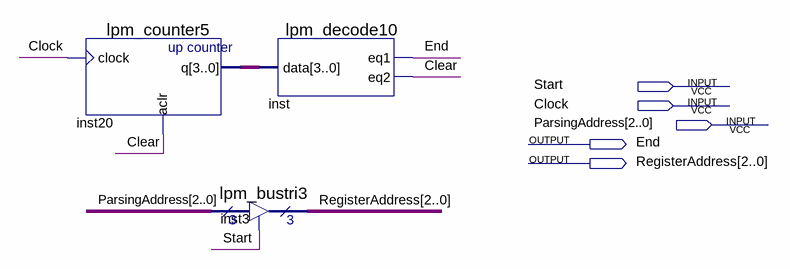
[diagram p0: schematic sheet]
// Quartus schematic Pop.bdf as structural Verilog: 3 symbols, 5 pins
module Pop (
  input  Start,
  input  Clock,
  input  [2:0] ParsingAddress,
  output End,
  output [2:0] RegisterAddress
);

  wire Clear;
  wire [3:0] inst20_q;

  lpm_counter5 inst20 (.clock(Clock), .aclr(Clear), .q(inst20_q));
  lpm_decode10 inst (.data(inst20_q), .eq1(End), .eq2(Clear));
  lpm_bustri3 inst3 (.enabledt(Start), .data(ParsingAddress), .tridata(RegisterAddress));
endmodule
